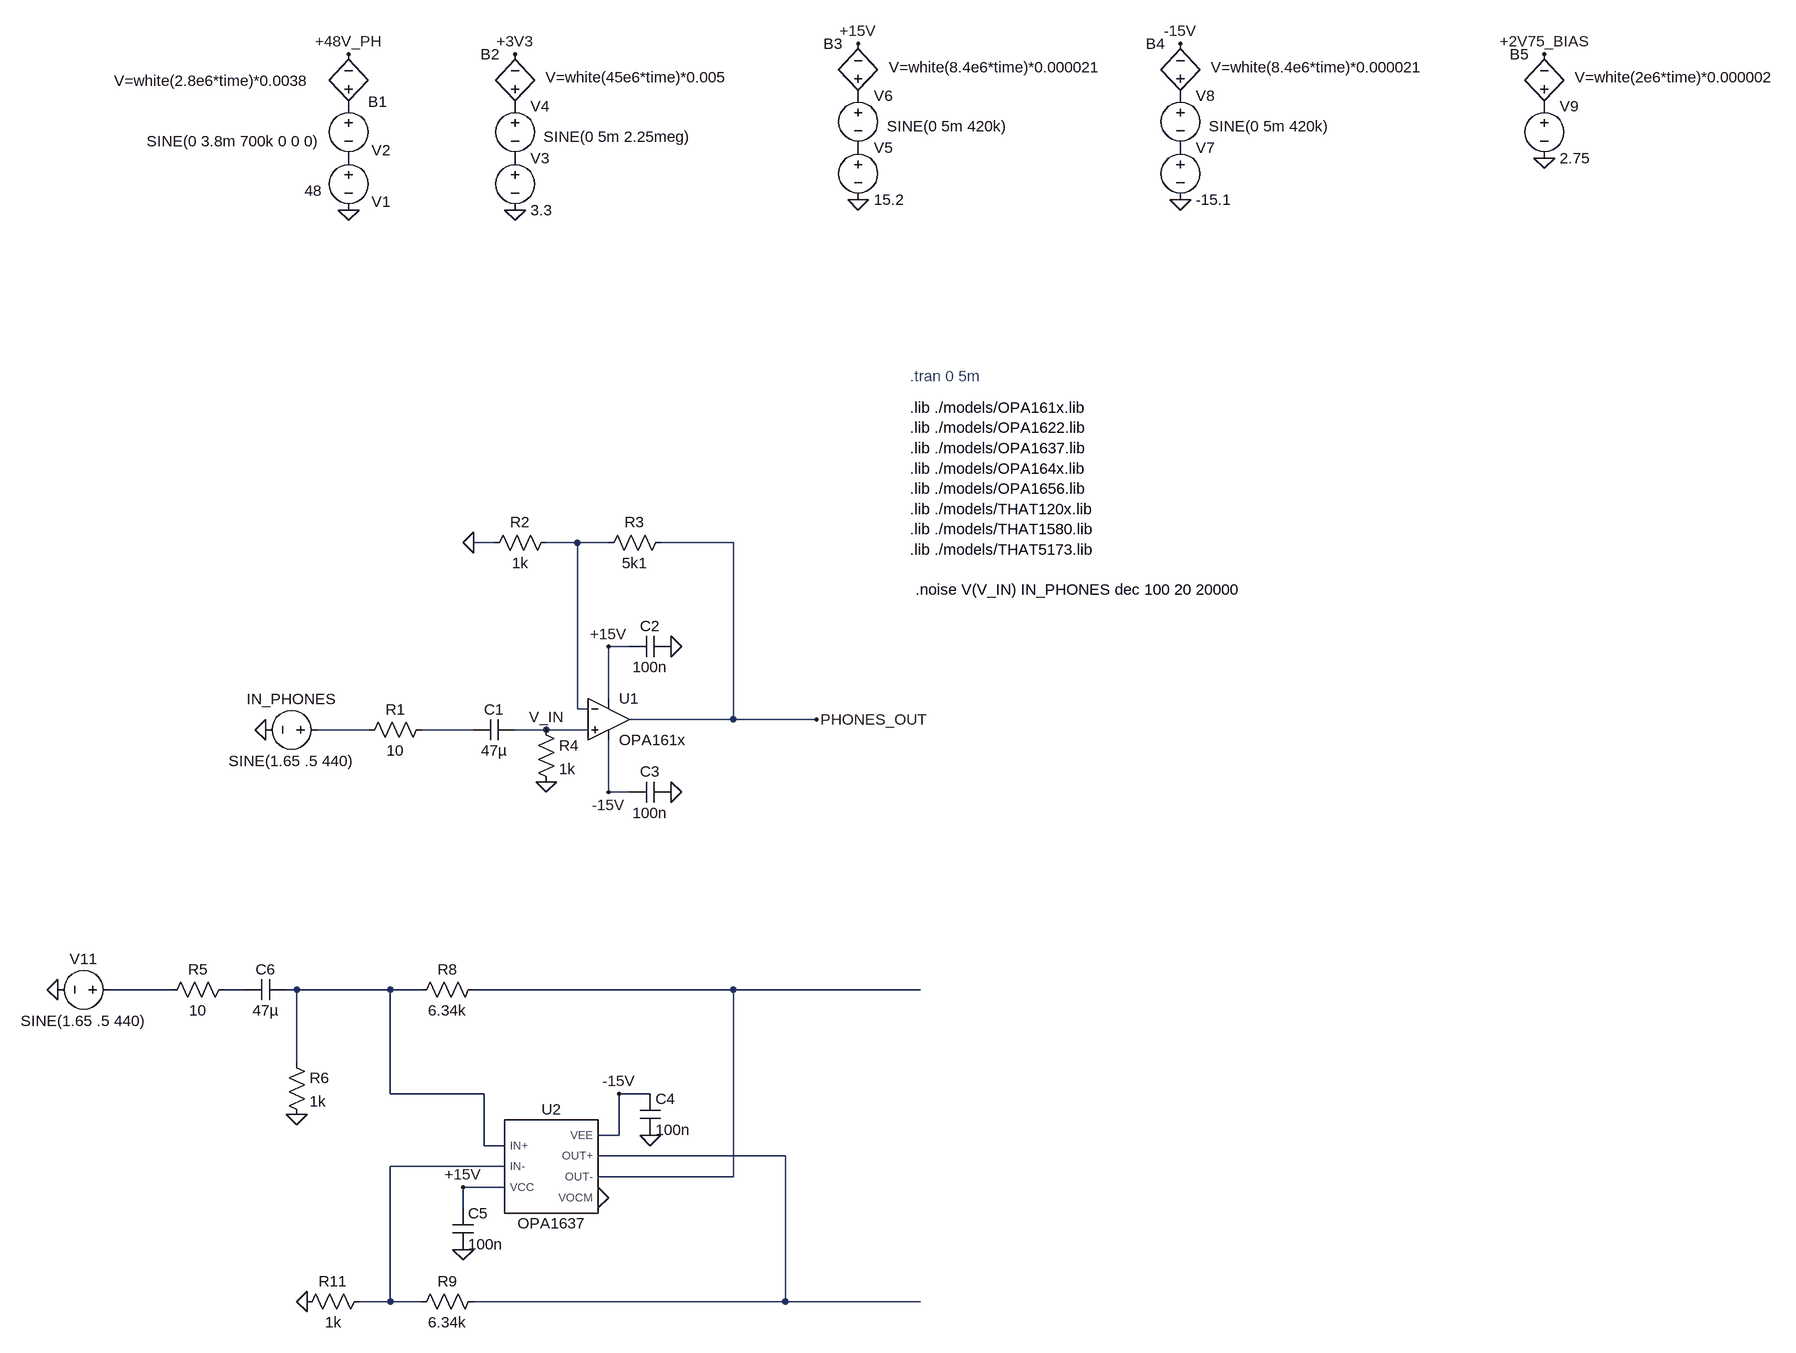
[diagram p0: schematic output.asc]
output.asc, the LTspice schematic file:
Version 4
SHEET 1 2588 1728
WIRE -272 512 -304 512
WIRE -144 512 -192 512
WIRE -96 512 -144 512
WIRE 96 512 -16 512
WIRE -64 672 -96 672
WIRE -96 752 -96 672
WIRE -144 768 -144 512
WIRE -128 768 -144 768
WIRE 96 784 96 512
WIRE 96 784 -64 784
WIRE 224 784 96 784
WIRE -464 800 -544 800
WIRE -304 800 -384 800
WIRE -192 800 -240 800
WIRE -128 800 -192 800
WIRE -96 896 -96 816
WIRE -64 896 -96 896
WIRE -768 1200 -864 1200
WIRE -656 1200 -688 1200
WIRE -576 1200 -592 1200
WIRE -432 1200 -576 1200
WIRE -384 1200 -432 1200
WIRE 96 1200 -304 1200
WIRE 384 1200 96 1200
WIRE -576 1312 -576 1200
WIRE -432 1360 -432 1200
WIRE -288 1360 -432 1360
WIRE -32 1360 -80 1360
WIRE -80 1424 -80 1360
WIRE -80 1424 -112 1424
WIRE -288 1440 -288 1360
WIRE -256 1440 -288 1440
WIRE 176 1456 -112 1456
WIRE -256 1472 -432 1472
WIRE 96 1488 96 1200
WIRE 96 1488 -112 1488
WIRE -256 1504 -320 1504
WIRE -320 1536 -320 1504
WIRE -432 1680 -432 1472
WIRE -432 1680 -480 1680
WIRE -384 1680 -432 1680
WIRE 176 1680 176 1456
WIRE 176 1680 -304 1680
WIRE 384 1680 176 1680
FLAG -496 0 0
FLAG -496 -240 +48V_PH
FLAG -240 0 0
FLAG -240 -240 +3V3
FLAG 288 -16 0
FLAG 288 -256 +15V
FLAG 784 -16 0
FLAG 784 -256 -15V
FLAG 1344 -80 0
FLAG 1344 -240 +2V75_BIAS
FLAG -624 800 0
FLAG 0 672 0
FLAG 0 896 0
FLAG -96 672 +15V
FLAG -96 896 -15V
FLAG -304 512 0
FLAG -192 880 0
FLAG -112 1520 0
FLAG -32 1424 0
FLAG -80 1360 -15V
FLAG -320 1600 0
FLAG -320 1504 +15V
FLAG -944 1200 0
FLAG -576 1392 0
FLAG -560 1680 0
FLAG 224 784 PHONES_OUT
FLAG -192 800 V_IN
SYMBOL Voltage -496 -96 R0
WINDOW 0 35 83 Left 2
WINDOW 3 -68 66 Left 2
SYMATTR InstName V1
SYMATTR Value 48
SYMBOL Voltage -496 -176 R0
WINDOW 3 -311 70 Left 2
WINDOW 0 35 84 Left 2
SYMATTR Value SINE(0 3.8m 700k 0 0 0)
SYMATTR InstName V2
SYMBOL bv -496 -144 R180
WINDOW 0 -59 23 Left 2
WINDOW 3 361 55 Right 2
SYMATTR InstName B1
SYMATTR Value V=white(2.8e6*time)*0.0038
SYMBOL Voltage -240 -96 R0
SYMATTR InstName V3
SYMATTR Value 3.3
SYMBOL Voltage -240 -176 R0
WINDOW 3 44 63 Left 2
SYMATTR Value SINE(0 5m 2.25meg)
SYMATTR InstName V4
SYMBOL bv -240 -144 R180
WINDOW 0 24 96 Left 2
WINDOW 3 -47 60 Right 2
SYMATTR InstName B2
SYMATTR Value V=white(45e6*time)*0.005
SYMBOL Voltage 288 -112 R0
SYMATTR InstName V5
SYMATTR Value 15.2
SYMBOL Voltage 288 -192 R0
WINDOW 3 44 63 Left 2
SYMATTR Value SINE(0 5m 420k)
SYMATTR InstName V6
SYMBOL bv 288 -160 R180
WINDOW 0 24 96 Left 2
WINDOW 3 -47 60 Right 2
SYMATTR InstName B3
SYMATTR Value V=white(8.4e6*time)*0.000021
SYMBOL Voltage 784 -112 R0
SYMATTR InstName V7
SYMATTR Value -15.1
SYMBOL Voltage 784 -192 R0
WINDOW 3 44 63 Left 2
SYMATTR Value SINE(0 5m 420k)
SYMATTR InstName V8
SYMBOL bv 784 -160 R180
WINDOW 0 24 96 Left 2
WINDOW 3 -47 60 Right 2
SYMATTR InstName B4
SYMATTR Value V=white(8.4e6*time)*0.000021
SYMBOL Voltage 1344 -176 R0
SYMATTR InstName V9
SYMATTR Value 2.75
SYMBOL bv 1344 -144 R180
WINDOW 0 24 96 Left 2
WINDOW 3 -47 60 Right 2
SYMATTR InstName B5
SYMATTR Value V=white(2e6*time)*0.000002
SYMBOL Voltage -528 800 R90
WINDOW 0 -32 56 VBottom 2
WINDOW 3 32 56 VTop 2
SYMATTR InstName IN_PHONES
SYMATTR Value SINE(1.65 .5 440)
SYMATTR Value2 AC 1
SYMATTR SpiceLine Cpar=2n
SYMBOL Res -368 784 R90
WINDOW 0 0 56 VBottom 2
WINDOW 3 32 56 VTop 2
SYMATTR InstName R1
SYMATTR Value 10
SYMBOL Cap -240 784 R90
WINDOW 0 0 32 VBottom 2
WINDOW 3 32 32 VTop 2
SYMATTR InstName C1
SYMATTR Value 47µ
SYMBOL OpAmps/opamp2 -96 720 R0
SYMATTR InstName U1
SYMATTR Value OPA161x
SYMBOL Cap 0 656 R90
WINDOW 0 0 32 VBottom 2
WINDOW 3 32 32 VTop 2
SYMATTR InstName C2
SYMATTR Value 100n
SYMBOL Cap 0 880 R90
WINDOW 0 0 32 VBottom 2
WINDOW 3 32 32 VTop 2
SYMATTR InstName C3
SYMATTR Value 100n
SYMBOL Res -176 496 R90
WINDOW 0 0 56 VBottom 2
WINDOW 3 32 56 VTop 2
SYMATTR InstName R2
SYMATTR Value 1k
SYMBOL Res 0 496 R90
WINDOW 0 0 56 VBottom 2
WINDOW 3 32 56 VTop 2
SYMATTR InstName R3
SYMATTR Value 5k1
SYMBOL Res -208 784 R0
SYMATTR InstName R4
SYMATTR Value 1k
SYMBOL OPA1637 -192 1472 R0
SYMATTR InstName U2
SYMBOL Cap -48 1360 R0
SYMATTR InstName C4
SYMATTR Value 100n
SYMBOL Cap -336 1536 R0
SYMATTR InstName C5
SYMATTR Value 100n
SYMBOL Res -288 1184 R90
WINDOW 0 0 56 VBottom 2
WINDOW 3 32 56 VTop 2
SYMATTR InstName R8
SYMATTR Value 6.34k
SYMBOL Res -288 1664 R90
WINDOW 0 0 56 VBottom 2
WINDOW 3 32 56 VTop 2
SYMATTR InstName R9
SYMATTR Value 6.34k
SYMBOL Res -464 1664 R90
WINDOW 0 0 56 VBottom 2
WINDOW 3 32 56 VTop 2
SYMATTR InstName R11
SYMATTR Value 1k
SYMBOL Voltage -848 1200 R90
WINDOW 0 -32 56 VBottom 2
WINDOW 3 32 56 VTop 2
SYMATTR InstName V11
SYMATTR Value SINE(1.65 .5 440)
SYMATTR Value2 AC 1
SYMATTR SpiceLine Cpar=2n
SYMBOL Res -672 1184 R90
WINDOW 0 0 56 VBottom 2
WINDOW 3 32 56 VTop 2
SYMATTR InstName R5
SYMATTR Value 10
SYMBOL Cap -592 1184 R90
WINDOW 0 0 32 VBottom 2
WINDOW 3 32 32 VTop 2
SYMATTR InstName C6
SYMATTR Value 47µ
SYMBOL Res -592 1296 R0
SYMATTR InstName R6
SYMATTR Value 1k
TEXT 368 304 Left 2 !.lib ./models/OPA161x.lib\n.lib ./models/OPA1622.lib\n.lib ./models/OPA1637.lib\n.lib ./models/OPA164x.lib\n.lib ./models/OPA1656.lib\n.lib ./models/THAT120x.lib\n.lib ./models/THAT1580.lib\n.lib ./models/THAT5173.lib
TEXT 368 256 Left 2 ;.tran 0 5m
TEXT 376 584 Left 2 !.noise V(V_IN) IN_PHONES dec 100 20 20000

The netlist it stands for:
* output.asc
V1 P001 0 48
V2 P002 P001 SINE(0 3.8m 700k 0 0 0)
B1 P002 +48V_PH V=white(2.8e6*time)*0.0038
V3 P003 0 3.3
V4 P004 P003 SINE(0 5m 2.25meg)
B2 P004 +3V3 V=white(45e6*time)*0.005
V5 P005 0 15.2
V6 P006 P005 SINE(0 5m 420k)
B3 P006 +15V V=white(8.4e6*time)*0.000021
V7 P007 0 -15.1
V8 P008 P007 SINE(0 5m 420k)
B4 P008 -15V V=white(8.4e6*time)*0.000021
V9 P009 0 2.75
B5 P009 +2V75_BIAS V=white(2e6*time)*0.000002
V§IN_PHONES N002 0 SINE(1.65 .5 440) AC 1 Cpar=2n
R1 N003 N002 10
C1 V_IN N003 47µ
XU1 V_IN N001 +15V -15V PHONES_OUT OPA161x  ; pins In+ In- V+ V- OUT
C2 0 +15V 100n
C3 0 -15V 100n
R2 N001 0 1k
R3 PHONES_OUT N001 5k1
R4 V_IN 0 1k
XU2 N006 N009 +15V -15V N008 N007 0 OPA1637  ; pins IN+ IN- VCC VEE OUT+ OUT- VOCM
C4 -15V 0 100n
C5 +15V 0 100n
R8 N007 N006 6.34k
R9 N008 N009 6.34k
R11 N009 0 1k
V11 N004 0 SINE(1.65 .5 440) AC 1 Cpar=2n
R5 N005 N004 10
C6 N006 N005 47µ
R6 N006 0 1k
.lib ./models/OPA161x.lib
.lib ./models/OPA1622.lib
.lib ./models/OPA1637.lib
.lib ./models/OPA164x.lib
.lib ./models/OPA1656.lib
.lib ./models/THAT120x.lib
.lib ./models/THAT1580.lib
.lib ./models/THAT5173.lib
* .tran 0 5m
.noise V(V_IN) IN_PHONES dec 100 20 20000
.lib /Users/oliver/dev/personal/openmic/simulations/models/OPA1637.lib
.backanno
.end